# Altium project lab_2_somov_boost.PrjPcb
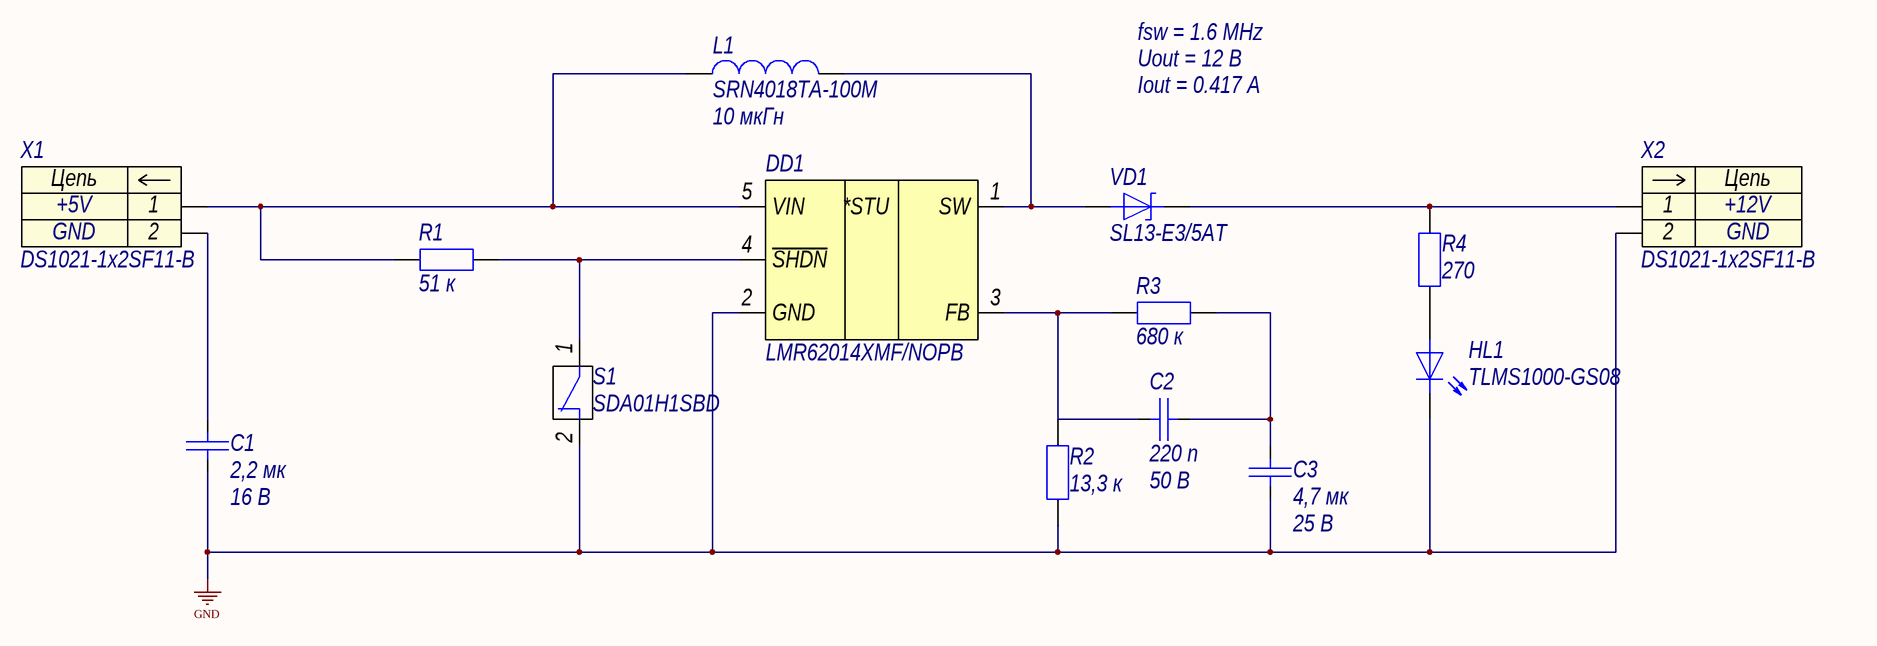
[diagram p0: lab_2_somov_boost.SchDoc]
approver: Утвердил; check: Проверяющий; designation: Введите номер сборки; developer: Разработчик; document_code: Ý3; document_type: Схема электрическая принципиальная; pcb_dec_number: Введите номер платы; project: Введите название проекта; sheets_total: M; title: Введите полное название схемы; title_line_1: Название; title_line_2: схемы
1 sheet, 14 parts. Net scope: global (net labels, ports and power ports of the same name join across sheets).
Board file: lab_2_somov_boost.PcbDoc

## Sheet lab_2_somov_boost.SchDoc: Введите полное название схемы
size 420 x 297 mm; ApprovedBy: Капустин; CheckedBy: Капустин; DrawnBy: Сомов; DocumentNumber: СПБПУ.3331506.023ЭЗ; SheetNumber: n; SheetTotal: 1; DocumentCode: Ý3; ImagePath: Введите номер платы

### Parts
C1  2,2 мк  Напряжение: 16 В  [C0603]
C2  220 п  Напряжение: 50 В  [C1206]
C3  4,7 мк  Напряжение: 25 В  [C0603]
DD1  LMR62014XMF/NOPB  [SOT-23-5]
HL1  TLMS1000-GS08  [HL0603]
L1  SRN4018TA-100M  Индуктивность: 10 мкГн  [SRN-2-400X400X180]
R1  51 к  [R0603]
R2  13,3 к  [R0603]
R3  680 к  [R0603]
R4  270  [R0603]
S1  SDA01H1SBD  [SDA01H1SBD]
VD1  SL13-E3/5AT  [DO-214AC]
X1  DS1021-1x2SF11-B  [DS1021-1X2SF11-B]
X2  DS1021-1x2SF11-B  [DS1021-1X2SF11-B]

### Nets
GND: C1.2 C3.1 DD1.2(GND) HL1.1 R2.1 S1.2 X2.2
NetC1_1: C1.1 X1.2
NetC2_1: C2.1 C3.2 R3.2
NetC2_2: C2.2 DD1.3(FB) R2.2 R3.1
NetDD1_1: DD1.1(SW) L1.2 VD1.2
NetDD1_4: DD1.4(~{SHDN}) R1.2 S1.1
NetDD1_5: DD1.5(VIN) L1.1 R1.1 X1.1
NetHL1_2: HL1.2 R4.1
NetR4_2: R4.2 VD1.1 X2.1

### Notes on the sheet
- fsw = 1.6 MHz
- Uout = 12 В
- Iout = 0.417 A
- Перв. примен.
- Справ. №
- Подп. и дата
- Инв. № дубл.
- Нормоконтроль:
- Взам. инв. №
- Изм.
- Лист
- № докум.
- Подп.
- Дата
- Лит.
- Масса
- Масштаб
- Т.контр.
- Пров.
- Разраб.
- Листов
- Разработал:
- Инв. № подл.
- Н.контр.
- Утв.
- Копировал
- Формат
- А3
- (in symbol dd0019) *STU
- (in symbol x0010) Цепь

### Library data of the parts
C1 = c0075: =Описание; ID: c0075; Фамилия: Паньков; Описание: Конденсатор чип 0603 2,2 мкФ 16 В ±10 %; Наименование: CC0603KRX7R7BB225; Производитель: YAGEO Corp.; Отклонение: ±10 %; Рабочие температуры: от –55 °С до +125 °С; Температурный коэффициент емкости: X7R; Корпус: 0603; Номинал: 2,2 мк; Номинальное напряжение: 16 В; HelpURL: https://www.yageo.com/upload/media/product/productsearch/datasheet/mlcc/UPY-GPHC_X7R_6.3V-to-50V_20.pdf
C2 = с0130: =Описание; ID: с0130; Фамилия: Сомов; Описание: безвыводные керамические неполярные конденсаторы 220 пФ 50В; Наименование: GRM2165C1H221J; Производитель: Murata; Отклонение: ±20 %; Рабочие температуры: от –55 °С до +125 °С; Номинал: 220 п; Номинальное напряжение: 50 В; HelpURL: https://static.chipdip.ru/lib/235/DOC000235066.pdf
C3 = c0087: =Описание; ID: c0087; Фамилия: Ларионов; Описание: Конденсатор чип 0603 4,7 мкФ 25 В ±10 %; Наименование: CC0603KRX5R8BB475; Производитель: YAGEO Corp.; Отклонение: ±10 %; Рабочие температуры: от –55 °С до +85 °С; Температурный коэффициент емкости: X5R; Корпус: 0603; Номинал: 4,7 мк; Номинальное напряжение: 25 В; HelpURL: https://www.yageo.com/upload/media/product/productsearch/datasheet/mlcc/UPY-GPHC_X5R_4V-to-50V_26.pdf
DD1 = dd0019: =Описание; ID: dd0019; Фамилия: Сомов; Описание: Повышающий преобразователь напряжения 20 В и 1,4 А; Производитель: Texas Instruments; Входное напряжение: от 2,7 В до 14 В; Выходное напряжение: до 20 В; Коммутируемый ток: до 1,4 А; Частота переключения: 1,6 МГц; Рабочие температуры: от –40 °С до +125 °С; Наименование: LMR62014XMF/NOPB; Корпус: SOT-23-5; HelpURL: https://www.ti.com/product/lmr62014
HL1 = hl0001: =Описание; ID: hl0001; Фамилия: Ларионов; Описание: Светодиод чип 0603 красный; Производитель: Vishay Intertechnology, Inc.; Цвет: Красный; Номинальная сила света: 4 мкд; Номинальная длина волны: 628 нм; Номинальный прямой ток: 15 мА; Номинальное падение напряжения: 1,8 В; Рассеиваемая мощность: 40 мВт; Рабочие температуры: от –40 °С до +100 °С; Корпус: 0603; Наименование: TLMS1000-GS08; HelpURL: https://www.vishay.com/leds/list/product-83172/
L1 = l0008: =Описание; ID: l0008; Фамилия: Самарин; Описание: Катушка индуктивности 10 мкГн ±20 %; Производитель: Bourns, Inc.; Отклонение: ±20 %; Номинальное активное сопротивление: 150 мОм; Резонансная частота: 35 МГц; Номинальный ток (при нагреве на 20 °С/40 °С): 1,5 А; Рабочее напряжение: не указано; Рабочие температуры: от –55 °С до +125 °С; Корпус: 4,0 x 4,0 x 1,8; Наименование: SRN4018TA-100M; Номинал: 10 мкГн; Максимальное активное сопротивление: 150 мОм; Ток насыщения: 1,5 А; HelpURL: https://www.bourns.com/products/magnetic-products/power-inductors-aec-q200-compliant/product/SRN4018TA
R1 = r0086: =Описание; ID: r0086; Фамилия: Паньков; Описание: Резистор чип 0603 51 кОм ±1 % 0,1 Вт; Наименование: RC0603FR-0751KL; Производитель: YAGEO Corp.; Отклонение: ±1 %; Номинальное напряжение: 75 В; Рабочие температуры: от –55 °С до +155 °С; Номинальный ток: 1 А; Корпус: 0603; Примечание: Ряд E24; Номинал: 51 к; HelpURL: https://www.yageo.com/upload/media/product/productsearch/datasheet/rchip/PYu-RC_Group_51_RoHS_L_11.pdf
R2 = r0131: =Описание; ID: r0131; Фамилия: Сомов; Описание: Резистор чип 0603 13,3 кОм ±1 % 0,1 Вт; Наименование: RN73C1J13K3BTDF; Производитель: YAGEO Corp.; Отклонение: ±1 %; Номинальное напряжение: 50 В; Рабочие температуры: от –55 °С до +155 °С; Номинальный ток: 1 А; Корпус: 603; Номинал: 13,3 к; HelpURL: http://www.farnell.com/datasheets/2095297.pdf
R3 = r0124: =Описание; ID: r0124; Фамилия: Паньков; Описание: Резистор чип 0603 680 кОм ±1 % 0,1 Вт; Наименование: RC0603FR-07680KL; Производитель: YAGEO Corp.; Отклонение: ±1 %; Номинальное напряжение: 75 В; Рабочие температуры: от –55 °С до +155 °С; Номинальный ток: 1 А; Корпус: 0603; Примечание: Ряд E24; Номинал: 680 к; HelpURL: https://www.yageo.com/upload/media/product/productsearch/datasheet/rchip/PYu-RC_Group_51_RoHS_L_11.pdf
R4 = r0017: =Описание; ID: r0017; Фамилия: Паньков; Описание: Резистор чип 0603 270 Ом ±1 % 0,1 Вт; Наименование: RC0603FR-07270RL; Производитель: YAGEO Corp.; Отклонение: ±1 %; Номинальное напряжение: 75 В; Рабочие температуры: от –55 °С до +155 °С; Номинальный ток: 1 А; Корпус: 0603; Примечание: Ряд E24; Номинал: 270; HelpURL: https://www.yageo.com/upload/media/product/productsearch/datasheet/rchip/PYu-RC_Group_51_RoHS_L_11.pdf
S1 = s0003: =Описание; ID: s0003; Фамилия: Паньков; Описание: 2-х позиционный движковый переключатель; Производитель: C&K; Ток нагрузки: 100 мА @ 5 В; Сопротивление контакта: 50 мОм; Количество контактов: 2; Рабочие температуры: от –40 °С до +85 °С; Промывка: Запрещена; Корпус: 4,52 х 9,30 х 5,45; Наименование: SDA01H1SBD; HelpURL: https://www.ckswitches.com/products/switches/product-details/DIP/SDA/SDA01H1SBD/
VD1 = vd0003: =Описание; ID: vd0003; Фамилия: Ларионов; Описание: Диод Шоттки 30 В 1,5 А; Производитель: Vishay Intertechnology, Inc.; Максимальнон прямое напряжение: 0,445 В; Максимальное обратное напряжение: 30 В; Максимальный прямой ток: 1,5 А; Рабочие температуры: от –55 °С до +125 °С; Наименование: SL13-E3/5AT; Корпус: DO-214AC; HelpURL: https://www.vishay.com/product?docid=88740
X1 = x0010: =Описание; Contact_1: +5V; Contact_2: GND; ID: x0010; Фамилия: Паньков; Описание: PLS 2 pin 2,54 мм вилка прямой; Производитель: Connfly Electronic Co., Ltd.; Наименование: DS1021-1x2SF11-B; HelpURL: http://en.connfly.group/product/xVkr=EusQssAN0gN=Aos=mU+UrVkR9kqEAN0gN9g+WqANB+A
X2 = x0010: =Описание; Contact_1: +12V; Contact_2: GND; ID: x0010; Фамилия: Паньков; Описание: PLS 2 pin 2,54 мм вилка прямой; Производитель: Connfly Electronic Co., Ltd.; Наименование: DS1021-1x2SF11-B; HelpURL: http://en.connfly.group/product/xVkr=EusQssAN0gN=Aos=mU+UrVkR9kqEAN0gN9g+WqANB+A